# EAGLE schematic SmartMatrixSD_V2 (EAGLE 6.4)
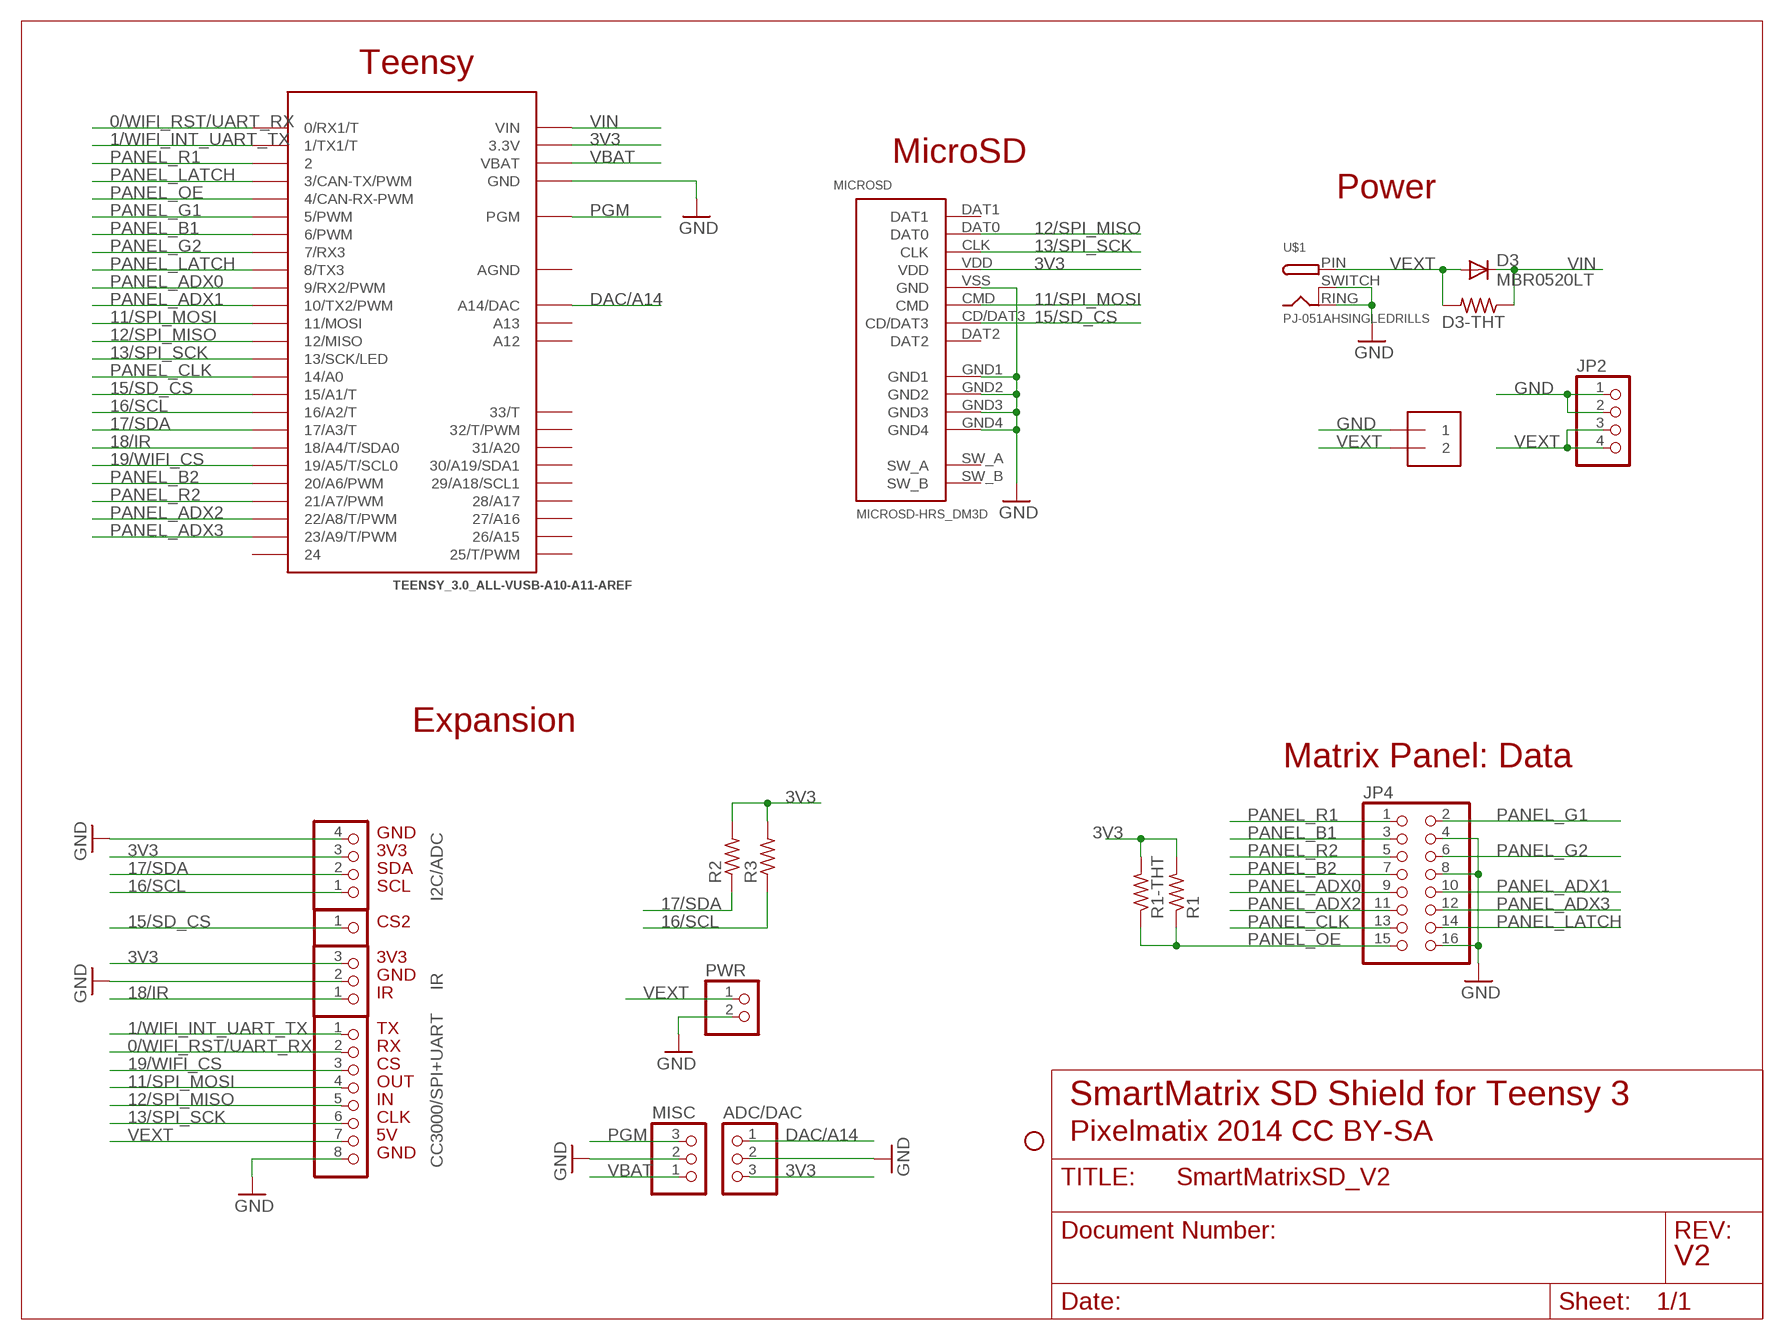
[diagram p0: schematic, sheet 1]

## Parts
ADC/DAC  PINHD-1X03_2.54-S  [1X03-S]
CC3000/SPI+UART  PINHD-1X08_2.54-S  [1X08-S]
CS2  PINHD-1X01_2.54-S  [1X01-S]
D3  MBR0520LT  [SOD123]
D3-THT  R-US_0207/2V  [0207/2V]
I2C/ADC  PINHD-1X04_2.54-S  [1X04-S]
IR  PINHD-1X03_2.54-S  [1X03-S]
J4  1X2-5.0  [1X2-5.0MM]
JP2  PINHD-1X04_1.56  [1X04-1.56"]
JP4  PINHD-2X08_2.54  [2X08]
JP5  STAND-OFFSTAND-OFF-3MM  [STAND-OFF-3MM]
MICROSD  MICROSD-HRS_DM3D  [DM3D]
MISC  PINHD-1X03_2.54-S  [1X03-S]
PWR  PINHD-1X02_2.54-S  [1X02-S]
R1  R-US_R0603  [R0603]
R1-THT  R-US_0207/2V  [0207/2V]
R2  R-US_0207/7  [0207/7]
R3  R-US_0207/7  [0207/7]
TEENSY  TEENSY_3.0_ALL-VUSB-A10-A11-AREF  [TEENSY_3.0_ALLPINS-VUSB-A11-A10-AREF]
U$1  PJ-051AHSINGLEDRILLS  [PJ-051AH-SINGLEDRILLS]

## Nets
0/WIFI_RST/UART_RX: CC3000/SPI+UART.2 TEENSY.0(0/RX1/T)
1/WIFI_INT_UART_TX: CC3000/SPI+UART.1 TEENSY.1(1/TX1/T)
3V3 [power]: ADC/DAC.3 I2C/ADC.3 IR.3 MICROSD.VDD R1-THT.2 R1.2 R2.2 R3.2 TEENSY.3.3V TEENSY.3.3V1(3.3V) TEENSY.3.3V2(3.3V)
11/SPI_MOSI: CC3000/SPI+UART.4 MICROSD.CMD TEENSY.11(11/MOSI)
12/SPI_MISO: CC3000/SPI+UART.5 MICROSD.DAT0 TEENSY.12(12/MISO)
13/SPI_SCK: CC3000/SPI+UART.6 MICROSD.CLK TEENSY.13(13/SCK/LED)
15/SD_CS: CS2.1 MICROSD.CD/DAT3 TEENSY.15/A1(15/A1/T)
16/SCL: I2C/ADC.1 R3.1 TEENSY.16/A2(16/A2/T)
17/SDA: I2C/ADC.2 R2.1 TEENSY.17/A3(17/A3/T)
18/IR: IR.1 TEENSY.18/A4(18/A4/T/SDA0)
19/WIFI_CS: CC3000/SPI+UART.3 TEENSY.19/A5(19/A5/T/SCL0)
DAC/A14: ADC/DAC.1 TEENSY.RESET(A14/DAC)
GND [power]: ADC/DAC.2 CC3000/SPI+UART.8 I2C/ADC.4 IR.2 J4.1 JP2.1 JP2.2 JP4.4 JP4.8 JP4.16 MICROSD.GND1 MICROSD.GND2 MICROSD.GND3 MICROSD.GND4 MICROSD.VSS(GND) MISC.2 PWR.2 TEENSY.GND TEENSY.GND1(GND) TEENSY.GND2(GND) U$1.RING(GND) U$1.SWITCH(GNDBREAK)
PANEL_ADX0: JP4.9 TEENSY.9(9/RX2/PWM)
PANEL_ADX1: JP4.10 TEENSY.10(10/TX2/PWM)
PANEL_ADX2: JP4.11 TEENSY.22/A8(22/A8/T/PWM)
PANEL_ADX3: JP4.12 TEENSY.23/A9(23/A9/T/PWM)
PANEL_B1: JP4.3 TEENSY.6(6/PWM)
PANEL_B2: JP4.7 TEENSY.20/A6(20/A6/PWM)
PANEL_CLK: JP4.13 TEENSY.14/A0
PANEL_G1: JP4.2 TEENSY.5(5/PWM)
PANEL_G2: JP4.6 TEENSY.7(7/RX3)
PANEL_LATCH: JP4.14 TEENSY.3(3/CAN-TX/PWM) TEENSY.8(8/TX3)
PANEL_OE: JP4.15 R1-THT.1 R1.1 TEENSY.4(4/CAN-RX-PWM)
PANEL_R1: JP4.1 TEENSY.2
PANEL_R2: JP4.5 TEENSY.21/A7(21/A7/PWM)
PGM: MISC.3 TEENSY.PGM
VBAT: MISC.1 TEENSY.VBAT
VEXT [power]: CC3000/SPI+UART.7 D3-THT.2 D3.A J4.2 JP2.3 JP2.4 PWR.1 U$1.PIN(PWR)
VIN [power]: D3-THT.1 D3.C TEENSY.VIN
Unconnected: MICROSD.DAT1 MICROSD.DAT2 MICROSD.SW_A MICROSD.SW_B TEENSY.24 TEENSY.25(25/T/PWM) TEENSY.26(26/A15) TEENSY.27(27/A16) TEENSY.28(28/A17) TEENSY.29(29/A18/SCL1) TEENSY.30(30/A19/SDA1) TEENSY.31(31/A20) TEENSY.32(32/T/PWM) TEENSY.33(33/T) TEENSY.A12 TEENSY.A13

## Notes on the sheet
- Teensy
- MicroSD
- Power
- Expansion
- Matrix Panel: Data
- GND
- 3V3
- SDA
- SCL
- CS2
- 3V3
- GND
- IR
- TX
- RX
- CS
- OUT
- IN | SmartMatrix SD Shield for Teensy 3
- CLK
- 5V | Pixelmatix 2014 CC BY-SA
- GND
- V2

## Power pins joined to a net without a drawn wire
AGND: TEENSY.AGND

## Library data of the parts
ADC/DAC IR MISC = pinhead-2:PINHD-1X03: PIN HEADER
CC3000/SPI+UART = pinhead-2:PINHD-1X08: PIN HEADER
CS2 = pinhead-2:PINHD-1X01: PIN HEADER
D3 = diode:MBR0520LT: SCHOTTKY BARRIER RECTIFIER Source: http://onsemi.com .. MBR0520LT1-D.pdf
D3-THT R1 R1-THT R2 R3 = rcl:R-US_: RESISTOR, American symbol
I2C/ADC = pinhead-2:PINHD-1X04: PIN HEADER
J4 = eclibrary:1X2: 3.5mm Terminal block - matches dimensions of 4Uconnector part# 19974 from http://www.ladyada.net/library/pcb/eaglelibrary.html 5.0mm Terminal block - matches dimensions of 4Uconnector part# 20182
JP2 = eclibrary:PINHD-1X04: PIN HEADER
JP4 = pinhead-2:PINHD-2X08: PIN HEADER
JP5 = eclibrary:STAND-OFF: Stand Off STAND-OFF-2.5MM is Using dimensions for 4.5mm diameter Hex Standoff (2.598mm keepout radius = outer radius of standoff) STAND-OFF-3MM is Using dimensions for a 6mm diameter Hex screw (3mm keepout radius), assuming a smaller 4.5mm diameter hex standoff is used Other parts are from sparkfun sample
MICROSD = hrs_DM3D-SF:MICROSD-HRS_DM3D
PWR = pinhead-2:PINHD-1X02: PIN HEADER
TEENSY = eclibrary:TEENSY_3.0_ALL-VUSB-A10-A11-AREF
U$1 = eclibrary:PJ-051AH

## Net classes
0 default: width 0.254 mm
1 power: width 0.406 mm